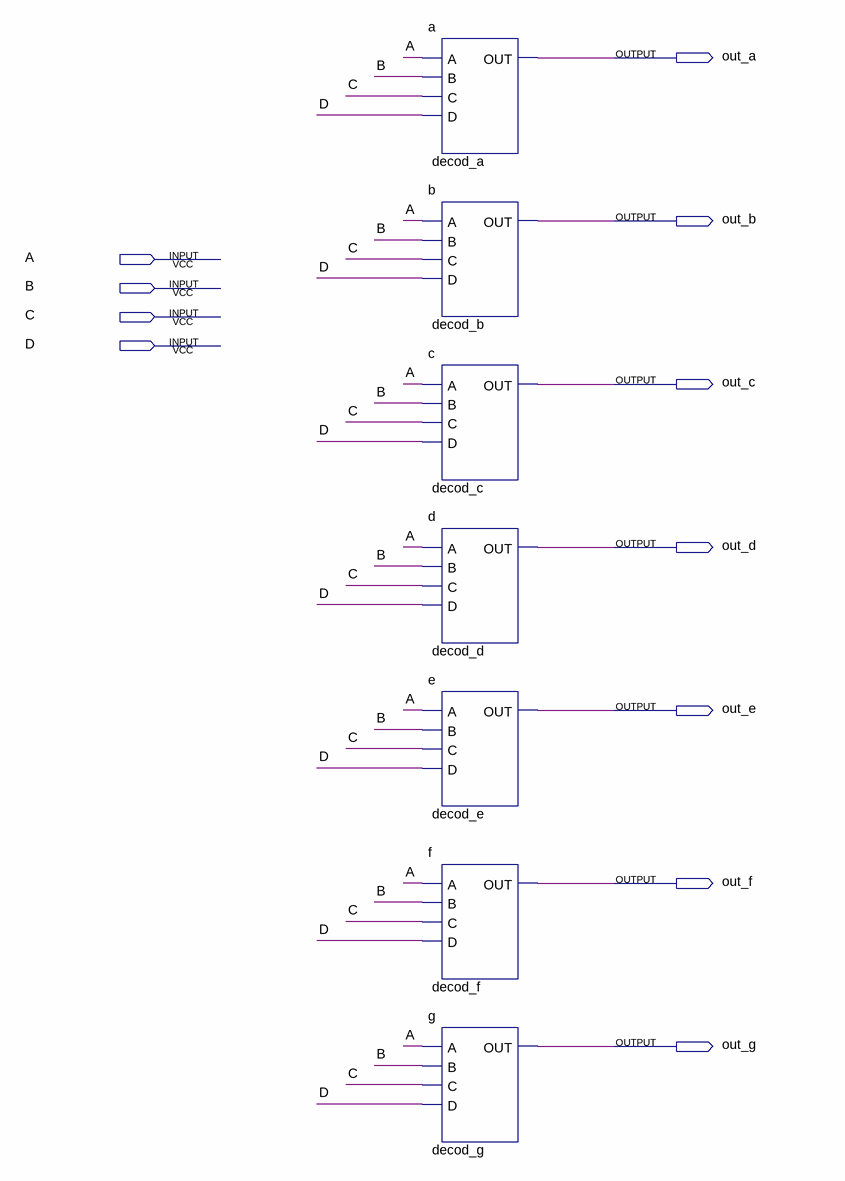
[diagram p0: schematic sheet]
// Quartus schematic circuito.bdf as structural Verilog: 7 symbols, 11 pins
module circuito (
  input  A,
  input  B,
  input  C,
  input  D,
  output out_a,
  output out_b,
  output out_c,
  output out_d,
  output out_e,
  output out_f,
  output out_g
);

  a decod_a (.A(A), .B(B), .C(C), .D(D), .OUT(out_a));
  b decod_b (.A(A), .B(B), .C(C), .D(D), .OUT(out_b));
  c decod_c (.A(A), .B(B), .C(C), .D(D), .OUT(out_c));
  d decod_d (.A(A), .B(B), .C(C), .D(D), .OUT(out_d));
  e decod_e (.A(A), .B(B), .C(C), .D(D), .OUT(out_e));
  f decod_f (.A(A), .B(B), .C(C), .D(D), .OUT(out_f));
  g decod_g (.A(A), .B(B), .C(C), .D(D), .OUT(out_g));
endmodule
